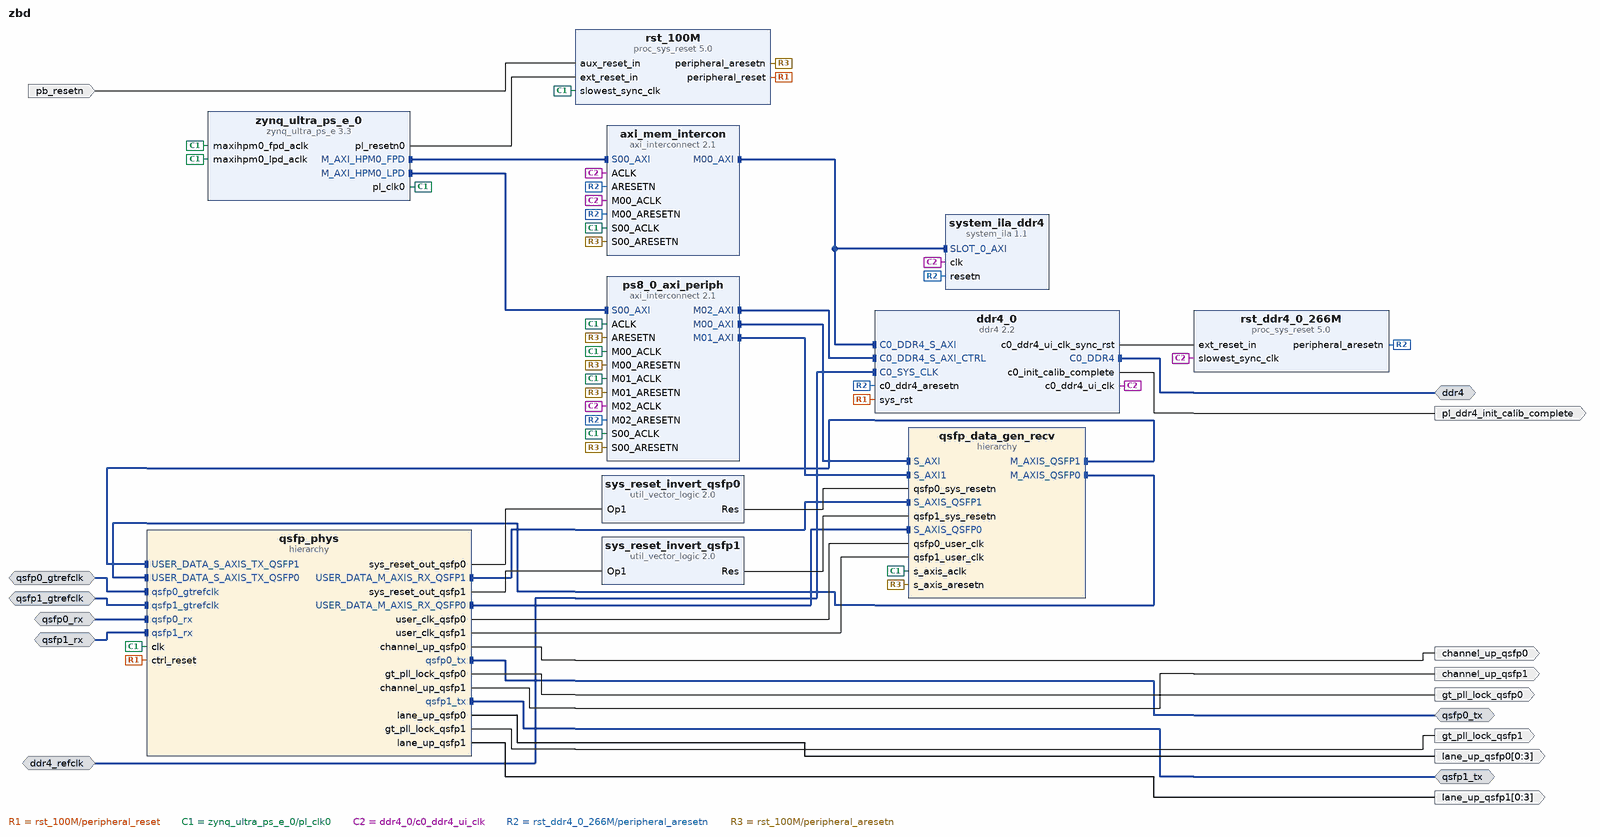
[diagram p0: block diagram of the top level]
# Vivado block design zbd, xczu19eg-ffvc1760-2-i, Vivado 2021.1
create_bd_design zbd

create_bd_intf_port -mode Master -vlnv xilinx.com:interface:ddr4_rtl:1.0 ddr4
create_bd_intf_port -mode Slave -vlnv xilinx.com:interface:diff_clock_rtl:1.0 ddr4_refclk
set_property -dict {CONFIG.FREQ_HZ 333333000} [get_bd_intf_ports ddr4_refclk]
create_bd_intf_port -mode Slave -vlnv xilinx.com:interface:diff_clock_rtl:1.0 qsfp0_gtrefclk
set_property -dict {CONFIG.FREQ_HZ 322265625} [get_bd_intf_ports qsfp0_gtrefclk]
create_bd_intf_port -mode Slave -vlnv xilinx.com:display_aurora:GT_Serial_Transceiver_Pins_RX_rtl:1.0 qsfp0_rx
create_bd_intf_port -mode Master -vlnv xilinx.com:display_aurora:GT_Serial_Transceiver_Pins_TX_rtl:1.0 qsfp0_tx
create_bd_intf_port -mode Slave -vlnv xilinx.com:interface:diff_clock_rtl:1.0 qsfp1_gtrefclk
set_property -dict {CONFIG.FREQ_HZ 322265625} [get_bd_intf_ports qsfp1_gtrefclk]
create_bd_intf_port -mode Slave -vlnv xilinx.com:display_aurora:GT_Serial_Transceiver_Pins_RX_rtl:1.0 qsfp1_rx
create_bd_intf_port -mode Master -vlnv xilinx.com:display_aurora:GT_Serial_Transceiver_Pins_TX_rtl:1.0 qsfp1_tx
create_bd_port -dir O channel_up_qsfp0
create_bd_port -dir O channel_up_qsfp1
create_bd_port -dir O gt_pll_lock_qsfp0
create_bd_port -dir O gt_pll_lock_qsfp1
create_bd_port -dir O -from 0 -to 3 lane_up_qsfp0
create_bd_port -dir O -from 0 -to 3 lane_up_qsfp1
create_bd_port -dir I -type rst pb_resetn
create_bd_port -dir O pl_ddr4_init_calib_complete

create_bd_cell -type hier qsfp_data_gen_recv
create_bd_cell -type hier qsfp_phys
create_bd_cell -type ip -vlnv xilinx.com:ip:proc_sys_reset:5.0 rst_100M
create_bd_cell -type ip -vlnv xilinx.com:ip:proc_sys_reset:5.0 rst_ddr4_0_266M
create_bd_cell -type ip -vlnv xilinx.com:ip:axi_interconnect:2.1 axi_mem_intercon
set_property -dict {CONFIG.NUM_MI 1} [get_bd_cells axi_mem_intercon]
create_bd_cell -type ip -vlnv xilinx.com:ip:ddr4:2.2 ddr4_0
set_property -dict [list \
  CONFIG.C0.CKE_WIDTH 2 \
  CONFIG.C0.CK_WIDTH 2 \
  CONFIG.C0.CS_WIDTH 2 \
  CONFIG.C0.DDR4_AxiAddressWidth 33 \
  CONFIG.C0.DDR4_AxiDataWidth 512 \
  CONFIG.C0.DDR4_CasLatency 15 \
  CONFIG.C0.DDR4_CasWriteLatency 11 \
  CONFIG.C0.DDR4_DataMask NO_DM_NO_DBI \
  CONFIG.C0.DDR4_DataWidth 72 \
  CONFIG.C0.DDR4_InputClockPeriod 3001 \
  CONFIG.C0.DDR4_MemoryPart MTA18ASF1G72HZ-2G3 \
  CONFIG.C0.DDR4_MemoryType SODIMMs \
  CONFIG.C0.DDR4_TimePeriod 938 \
  CONFIG.C0.ODT_WIDTH 2 \
] [get_bd_cells ddr4_0]
create_bd_cell -type ip -vlnv xilinx.com:ip:axi_interconnect:2.1 ps8_0_axi_periph
set_property -dict {CONFIG.NUM_MI 3} [get_bd_cells ps8_0_axi_periph]
create_bd_cell -type ip -vlnv xilinx.com:ip:util_vector_logic:2.0 sys_reset_invert_qsfp0
set_property -dict {CONFIG.C_OPERATION not CONFIG.C_SIZE 1} [get_bd_cells sys_reset_invert_qsfp0]
create_bd_cell -type ip -vlnv xilinx.com:ip:util_vector_logic:2.0 sys_reset_invert_qsfp1
set_property -dict {CONFIG.C_OPERATION not CONFIG.C_SIZE 1} [get_bd_cells sys_reset_invert_qsfp1]
create_bd_cell -type ip -vlnv xilinx.com:ip:system_ila:1.1 system_ila_ddr4
set_property -dict [list \
  CONFIG.ALL_PROBE_SAME_MU_CNT 2 \
  CONFIG.C_DATA_DEPTH 4096 \
  CONFIG.C_EN_STRG_QUAL 1 \
  CONFIG.C_MON_TYPE INTERFACE \
  CONFIG.C_PROBE0_MU_CNT 2 \
] [get_bd_cells system_ila_ddr4]
create_bd_cell -type ip -vlnv xilinx.com:ip:zynq_ultra_ps_e:3.3 zynq_ultra_ps_e_0
set_property -dict [list \
  CONFIG.CAN0_BOARD_INTERFACE custom \
  CONFIG.CAN1_BOARD_INTERFACE custom \
  CONFIG.CSU_BOARD_INTERFACE custom \
  CONFIG.DP_BOARD_INTERFACE custom \
  CONFIG.GEM0_BOARD_INTERFACE custom \
  CONFIG.GEM1_BOARD_INTERFACE custom \
  CONFIG.GEM2_BOARD_INTERFACE custom \
  CONFIG.GEM3_BOARD_INTERFACE custom \
  CONFIG.GPIO_BOARD_INTERFACE custom \
  CONFIG.IIC0_BOARD_INTERFACE custom \
  CONFIG.IIC1_BOARD_INTERFACE custom \
  CONFIG.NAND_BOARD_INTERFACE custom \
  CONFIG.PCIE_BOARD_INTERFACE custom \
  CONFIG.PJTAG_BOARD_INTERFACE custom \
  CONFIG.PMU_BOARD_INTERFACE custom \
  CONFIG.PSU_BANK_0_IO_STANDARD LVCMOS33 \
  CONFIG.PSU_BANK_1_IO_STANDARD LVCMOS33 \
  CONFIG.PSU_BANK_2_IO_STANDARD LVCMOS33 \
  CONFIG.PSU_BANK_3_IO_STANDARD LVCMOS33 \
  CONFIG.PSU_USB3__DUAL_CLOCK_ENABLE 0 \
  CONFIG.PSU__CAN1__PERIPHERAL__ENABLE 0 \
  CONFIG.PSU__CRF_APB__ACPU_CTRL__FREQMHZ 1333.333 \
  CONFIG.PSU__CRF_APB__ACPU_CTRL__SRCSEL APLL \
  CONFIG.PSU__CRF_APB__APLL_CTRL__SRCSEL PSS_REF_CLK \
  CONFIG.PSU__CRF_APB__DBG_FPD_CTRL__FREQMHZ 250 \
  CONFIG.PSU__CRF_APB__DBG_FPD_CTRL__SRCSEL IOPLL \
  CONFIG.PSU__CRF_APB__DBG_TRACE_CTRL__FREQMHZ 250 \
  CONFIG.PSU__CRF_APB__DBG_TRACE_CTRL__SRCSEL IOPLL \
  CONFIG.PSU__CRF_APB__DBG_TSTMP_CTRL__FREQMHZ 250 \
  CONFIG.PSU__CRF_APB__DBG_TSTMP_CTRL__SRCSEL IOPLL \
  CONFIG.PSU__CRF_APB__DDR_CTRL__FREQMHZ 800 \
  CONFIG.PSU__CRF_APB__DDR_CTRL__SRCSEL DPLL \
  CONFIG.PSU__CRF_APB__DPDMA_REF_CTRL__FREQMHZ 600 \
  CONFIG.PSU__CRF_APB__DPDMA_REF_CTRL__SRCSEL APLL \
  CONFIG.PSU__CRF_APB__DPLL_CTRL__SRCSEL PSS_REF_CLK \
  CONFIG.PSU__CRF_APB__DP_AUDIO_REF_CTRL__SRCSEL RPLL \
  CONFIG.PSU__CRF_APB__DP_STC_REF_CTRL__SRCSEL RPLL \
  CONFIG.PSU__CRF_APB__DP_VIDEO_REF_CTRL__SRCSEL VPLL \
  CONFIG.PSU__CRF_APB__GDMA_REF_CTRL__FREQMHZ 600 \
  CONFIG.PSU__CRF_APB__GDMA_REF_CTRL__SRCSEL APLL \
  CONFIG.PSU__CRF_APB__GPU_REF_CTRL__FREQMHZ 600 \
  CONFIG.PSU__CRF_APB__GPU_REF_CTRL__SRCSEL DPLL \
  CONFIG.PSU__CRF_APB__TOPSW_LSBUS_CTRL__FREQMHZ 100 \
  CONFIG.PSU__CRF_APB__TOPSW_LSBUS_CTRL__SRCSEL IOPLL \
  CONFIG.PSU__CRF_APB__TOPSW_MAIN_CTRL__FREQMHZ 533.33 \
  CONFIG.PSU__CRF_APB__TOPSW_MAIN_CTRL__SRCSEL VPLL \
  CONFIG.PSU__CRF_APB__VPLL_CTRL__SRCSEL PSS_REF_CLK \
  CONFIG.PSU__CRL_APB__ADMA_REF_CTRL__FREQMHZ 500 \
  CONFIG.PSU__CRL_APB__ADMA_REF_CTRL__SRCSEL IOPLL \
  CONFIG.PSU__CRL_APB__CAN1_REF_CTRL__FREQMHZ 100 \
  CONFIG.PSU__CRL_APB__CAN1_REF_CTRL__SRCSEL IOPLL \
  CONFIG.PSU__CRL_APB__CPU_R5_CTRL__FREQMHZ 533.333 \
  CONFIG.PSU__CRL_APB__CPU_R5_CTRL__SRCSEL IOPLL \
  CONFIG.PSU__CRL_APB__DBG_LPD_CTRL__FREQMHZ 250 \
  CONFIG.PSU__CRL_APB__DBG_LPD_CTRL__SRCSEL IOPLL \
  CONFIG.PSU__CRL_APB__DLL_REF_CTRL__FREQMHZ 200 \
  CONFIG.PSU__CRL_APB__GEM3_REF_CTRL__FREQMHZ 125 \
  CONFIG.PSU__CRL_APB__GEM3_REF_CTRL__SRCSEL IOPLL \
  CONFIG.PSU__CRL_APB__I2C0_REF_CTRL__FREQMHZ 100 \
  CONFIG.PSU__CRL_APB__I2C0_REF_CTRL__SRCSEL IOPLL \
  CONFIG.PSU__CRL_APB__I2C1_REF_CTRL__FREQMHZ 100 \
  CONFIG.PSU__CRL_APB__I2C1_REF_CTRL__SRCSEL IOPLL \
  CONFIG.PSU__CRL_APB__IOPLL_CTRL__SRCSEL PSS_REF_CLK \
  CONFIG.PSU__CRL_APB__IOU_SWITCH_CTRL__FREQMHZ 267 \
  CONFIG.PSU__CRL_APB__IOU_SWITCH_CTRL__SRCSEL RPLL \
  CONFIG.PSU__CRL_APB__LPD_LSBUS_CTRL__FREQMHZ 100 \
  CONFIG.PSU__CRL_APB__LPD_LSBUS_CTRL__SRCSEL IOPLL \
  CONFIG.PSU__CRL_APB__LPD_SWITCH_CTRL__FREQMHZ 533.333 \
  CONFIG.PSU__CRL_APB__LPD_SWITCH_CTRL__SRCSEL IOPLL \
  CONFIG.PSU__CRL_APB__PCAP_CTRL__FREQMHZ 200 \
  CONFIG.PSU__CRL_APB__PCAP_CTRL__SRCSEL IOPLL \
  CONFIG.PSU__CRL_APB__PL0_REF_CTRL__FREQMHZ 100 \
  CONFIG.PSU__CRL_APB__PL0_REF_CTRL__SRCSEL RPLL \
  CONFIG.PSU__CRL_APB__QSPI_REF_CTRL__FREQMHZ 300 \
  CONFIG.PSU__CRL_APB__QSPI_REF_CTRL__SRCSEL IOPLL \
  CONFIG.PSU__CRL_APB__RPLL_CTRL__SRCSEL PSS_REF_CLK \
  CONFIG.PSU__CRL_APB__SDIO1_REF_CTRL__FREQMHZ 200 \
  CONFIG.PSU__CRL_APB__SDIO1_REF_CTRL__SRCSEL RPLL \
  CONFIG.PSU__CRL_APB__TIMESTAMP_REF_CTRL__FREQMHZ 33.333 \
  CONFIG.PSU__CRL_APB__TIMESTAMP_REF_CTRL__SRCSEL PSS_REF_CLK \
  CONFIG.PSU__CRL_APB__UART0_REF_CTRL__FREQMHZ 100 \
  CONFIG.PSU__CRL_APB__UART0_REF_CTRL__SRCSEL IOPLL \
  CONFIG.PSU__CRL_APB__UART1_REF_CTRL__FREQMHZ 100 \
  CONFIG.PSU__CRL_APB__UART1_REF_CTRL__SRCSEL IOPLL \
  CONFIG.PSU__CRL_APB__USB0_BUS_REF_CTRL__FREQMHZ 250 \
  CONFIG.PSU__CRL_APB__USB0_BUS_REF_CTRL__SRCSEL IOPLL \
  CONFIG.PSU__CRL_APB__USB3_DUAL_REF_CTRL__FREQMHZ 20 \
  CONFIG.PSU__CRL_APB__USB3_DUAL_REF_CTRL__SRCSEL IOPLL \
  CONFIG.PSU__CRL_APB__USB3__ENABLE 0 \
  CONFIG.PSU__CSUPMU__PERIPHERAL__VALID 0 \
  CONFIG.PSU__DDRC__BUS_WIDTH {64 Bit} \
  CONFIG.PSU__DDRC__COMPONENTS UDIMM \
  CONFIG.PSU__DDRC__DEVICE_CAPACITY {8192 MBits} \
  CONFIG.PSU__DDRC__DRAM_WIDTH {8 Bits} \
  CONFIG.PSU__DDRC__ECC Disabled \
  CONFIG.PSU__DDRC__MEMORY_TYPE {DDR 4} \
  CONFIG.PSU__DDRC__SPEED_BIN DDR4_1600K \
  CONFIG.PSU__DDR_HIGH_ADDRESS_GUI_ENABLE 1 \
  CONFIG.PSU__DDR__INTERFACE__FREQMHZ 400.000 \
  CONFIG.PSU__DEVICE_TYPE EG \
  CONFIG.PSU__DISPLAYPORT__PERIPHERAL__ENABLE 0 \
  CONFIG.PSU__DLL__ISUSED 1 \
  CONFIG.PSU__ENET3__FIFO__ENABLE 0 \
  CONFIG.PSU__ENET3__GRP_MDIO__ENABLE 1 \
  CONFIG.PSU__ENET3__GRP_MDIO__IO {MIO 76 .. 77} \
  CONFIG.PSU__ENET3__PERIPHERAL__ENABLE 1 \
  CONFIG.PSU__ENET3__PERIPHERAL__IO {MIO 64 .. 75} \
  CONFIG.PSU__ENET3__PTP__ENABLE 0 \
  CONFIG.PSU__ENET3__TSU__ENABLE 0 \
  CONFIG.PSU__FPGA_PL0_ENABLE 1 \
  CONFIG.PSU__GEM3_COHERENCY 0 \
  CONFIG.PSU__GEM3_ROUTE_THROUGH_FPD 0 \
  CONFIG.PSU__GEM__TSU__ENABLE 0 \
  CONFIG.PSU__GPIO0_MIO__IO {MIO 0 .. 25} \
  CONFIG.PSU__GPIO0_MIO__PERIPHERAL__ENABLE 1 \
  CONFIG.PSU__GPIO1_MIO__IO {MIO 26 .. 51} \
  CONFIG.PSU__GPIO1_MIO__PERIPHERAL__ENABLE 1 \
  CONFIG.PSU__I2C0__PERIPHERAL__ENABLE 1 \
  CONFIG.PSU__I2C0__PERIPHERAL__IO {MIO 14 .. 15} \
  CONFIG.PSU__I2C1__PERIPHERAL__ENABLE 1 \
  CONFIG.PSU__I2C1__PERIPHERAL__IO {MIO 16 .. 17} \
  CONFIG.PSU__IOU_SLCR__IOU_TTC_APB_CLK__TTC0_SEL APB \
  CONFIG.PSU__IOU_SLCR__IOU_TTC_APB_CLK__TTC1_SEL APB \
  CONFIG.PSU__IOU_SLCR__IOU_TTC_APB_CLK__TTC2_SEL APB \
  CONFIG.PSU__IOU_SLCR__IOU_TTC_APB_CLK__TTC3_SEL APB \
  CONFIG.PSU__LPD_SLCR__CSUPMU__FREQMHZ 100 \
  CONFIG.PSU__MAXIGP0__DATA_WIDTH 64 \
  CONFIG.PSU__OVERRIDE_HPX_QOS 0 \
  CONFIG.PSU__OVERRIDE__BASIC_CLOCK 1 \
  CONFIG.PSU__PMU__PERIPHERAL__ENABLE 0 \
  CONFIG.PSU__PRESET_APPLIED 1 \
  CONFIG.PSU__PSS_REF_CLK__FREQMHZ 33.333 \
  CONFIG.PSU__QSPI_COHERENCY 0 \
  CONFIG.PSU__QSPI_ROUTE_THROUGH_FPD 0 \
  CONFIG.PSU__QSPI__GRP_FBCLK__ENABLE 1 \
  CONFIG.PSU__QSPI__GRP_FBCLK__IO {MIO 6} \
  CONFIG.PSU__QSPI__PERIPHERAL__DATA_MODE x4 \
  CONFIG.PSU__QSPI__PERIPHERAL__ENABLE 1 \
  CONFIG.PSU__QSPI__PERIPHERAL__IO {MIO 0 .. 12} \
  CONFIG.PSU__QSPI__PERIPHERAL__MODE {Dual Parallel} \
  CONFIG.PSU__SATA__PERIPHERAL__ENABLE 0 \
  CONFIG.PSU__SD1_COHERENCY 0 \
  CONFIG.PSU__SD1_ROUTE_THROUGH_FPD 0 \
  CONFIG.PSU__SD1__DATA_TRANSFER_MODE 4Bit \
  CONFIG.PSU__SD1__GRP_CD__ENABLE 1 \
  CONFIG.PSU__SD1__GRP_CD__IO {MIO 45} \
  CONFIG.PSU__SD1__GRP_POW__ENABLE 1 \
  CONFIG.PSU__SD1__GRP_POW__IO {MIO 43} \
  CONFIG.PSU__SD1__GRP_WP__ENABLE 1 \
  CONFIG.PSU__SD1__GRP_WP__IO {MIO 44} \
  CONFIG.PSU__SD1__PERIPHERAL__ENABLE 1 \
  CONFIG.PSU__SD1__PERIPHERAL__IO {MIO 46 .. 51} \
  CONFIG.PSU__SD1__SLOT_TYPE {SD 2.0} \
  CONFIG.PSU__SWDT0__CLOCK__ENABLE 0 \
  CONFIG.PSU__SWDT0__PERIPHERAL__ENABLE 1 \
  CONFIG.PSU__SWDT0__RESET__ENABLE 0 \
  CONFIG.PSU__SWDT1__CLOCK__ENABLE 0 \
  CONFIG.PSU__SWDT1__PERIPHERAL__ENABLE 1 \
  CONFIG.PSU__SWDT1__RESET__ENABLE 0 \
  CONFIG.PSU__TSU__BUFG_PORT_PAIR 0 \
  CONFIG.PSU__TTC0__CLOCK__ENABLE 0 \
  CONFIG.PSU__TTC0__PERIPHERAL__ENABLE 1 \
  CONFIG.PSU__TTC0__WAVEOUT__ENABLE 0 \
  CONFIG.PSU__TTC1__CLOCK__ENABLE 0 \
  CONFIG.PSU__TTC1__PERIPHERAL__ENABLE 1 \
  CONFIG.PSU__TTC1__WAVEOUT__ENABLE 0 \
  CONFIG.PSU__TTC2__CLOCK__ENABLE 0 \
  CONFIG.PSU__TTC2__PERIPHERAL__ENABLE 1 \
  CONFIG.PSU__TTC2__WAVEOUT__ENABLE 0 \
  CONFIG.PSU__TTC3__CLOCK__ENABLE 0 \
  CONFIG.PSU__TTC3__PERIPHERAL__ENABLE 1 \
  CONFIG.PSU__TTC3__WAVEOUT__ENABLE 0 \
  CONFIG.PSU__UART0__BAUD_RATE 115200 \
  CONFIG.PSU__UART0__MODEM__ENABLE 0 \
  CONFIG.PSU__UART0__PERIPHERAL__ENABLE 1 \
  CONFIG.PSU__UART0__PERIPHERAL__IO {MIO 18 .. 19} \
  CONFIG.PSU__UART1__BAUD_RATE 115200 \
  CONFIG.PSU__UART1__MODEM__ENABLE 0 \
  CONFIG.PSU__UART1__PERIPHERAL__ENABLE 1 \
  CONFIG.PSU__UART1__PERIPHERAL__IO {MIO 20 .. 21} \
  CONFIG.PSU__USB0__PERIPHERAL__ENABLE 0 \
  CONFIG.PSU__USE__IRQ0 0 \
  CONFIG.PSU__USE__M_AXI_GP0 1 \
  CONFIG.PSU__USE__M_AXI_GP1 0 \
  CONFIG.PSU__USE__M_AXI_GP2 1 \
  CONFIG.QSPI_BOARD_INTERFACE custom \
  CONFIG.SATA_BOARD_INTERFACE custom \
  CONFIG.SD0_BOARD_INTERFACE custom \
  CONFIG.SD1_BOARD_INTERFACE custom \
  CONFIG.SPI0_BOARD_INTERFACE custom \
  CONFIG.SPI1_BOARD_INTERFACE custom \
  CONFIG.SUBPRESET1 Custom \
  CONFIG.SUBPRESET2 Custom \
  CONFIG.SWDT0_BOARD_INTERFACE custom \
  CONFIG.SWDT1_BOARD_INTERFACE custom \
  CONFIG.TRACE_BOARD_INTERFACE custom \
  CONFIG.TTC0_BOARD_INTERFACE custom \
  CONFIG.TTC1_BOARD_INTERFACE custom \
  CONFIG.TTC2_BOARD_INTERFACE custom \
  CONFIG.TTC3_BOARD_INTERFACE custom \
  CONFIG.UART0_BOARD_INTERFACE custom \
  CONFIG.UART1_BOARD_INTERFACE custom \
  CONFIG.USB0_BOARD_INTERFACE custom \
  CONFIG.USB1_BOARD_INTERFACE custom \
] [get_bd_cells zynq_ultra_ps_e_0]
# 845 more settings of zynq_ultra_ps_e_0 are not shown: defaults, MIO pin electricals, DDR timing, and values the tool derives

# ---- hierarchy /qsfp_data_gen_recv ----
current_bd_instance /qsfp_data_gen_recv
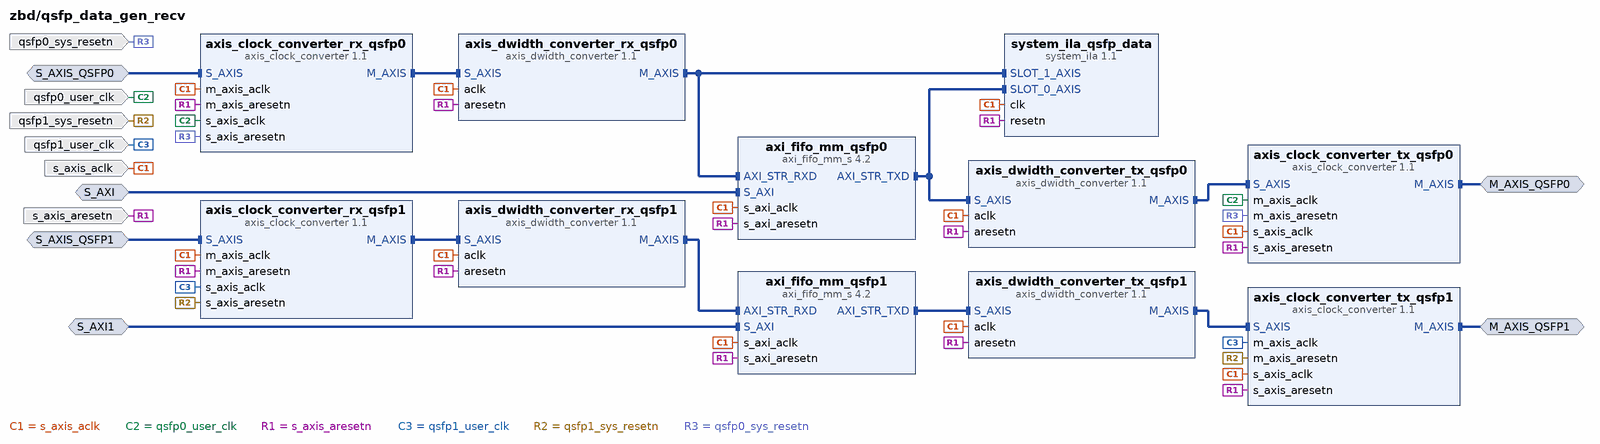
[diagram p1: block diagram inside /qsfp_data_gen_recv]
create_bd_intf_pin -mode Master -vlnv xilinx.com:interface:axis_rtl:1.0 M_AXIS_QSFP0
create_bd_intf_pin -mode Master -vlnv xilinx.com:interface:axis_rtl:1.0 M_AXIS_QSFP1
create_bd_intf_pin -mode Slave -vlnv xilinx.com:interface:aximm_rtl:1.0 S_AXI
create_bd_intf_pin -mode Slave -vlnv xilinx.com:interface:aximm_rtl:1.0 S_AXI1
create_bd_intf_pin -mode Slave -vlnv xilinx.com:interface:axis_rtl:1.0 S_AXIS_QSFP0
create_bd_intf_pin -mode Slave -vlnv xilinx.com:interface:axis_rtl:1.0 S_AXIS_QSFP1
create_bd_pin -dir I -type rst qsfp0_sys_resetn
create_bd_pin -dir I -type clk qsfp0_user_clk
create_bd_pin -dir I -type rst qsfp1_sys_resetn
create_bd_pin -dir I -type clk qsfp1_user_clk
create_bd_pin -dir I -type clk s_axis_aclk
create_bd_pin -dir I -type rst s_axis_aresetn

create_bd_cell -type ip -vlnv xilinx.com:ip:axi_fifo_mm_s:4.2 axi_fifo_mm_qsfp0
set_property -dict {CONFIG.C_USE_TX_CTRL 0} [get_bd_cells axi_fifo_mm_qsfp0]
create_bd_cell -type ip -vlnv xilinx.com:ip:axi_fifo_mm_s:4.2 axi_fifo_mm_qsfp1
set_property -dict {CONFIG.C_USE_TX_CTRL 0} [get_bd_cells axi_fifo_mm_qsfp1]
create_bd_cell -type ip -vlnv xilinx.com:ip:axis_clock_converter:1.1 axis_clock_converter_rx_qsfp0
create_bd_cell -type ip -vlnv xilinx.com:ip:axis_clock_converter:1.1 axis_clock_converter_rx_qsfp1
create_bd_cell -type ip -vlnv xilinx.com:ip:axis_clock_converter:1.1 axis_clock_converter_tx_qsfp0
create_bd_cell -type ip -vlnv xilinx.com:ip:axis_clock_converter:1.1 axis_clock_converter_tx_qsfp1
create_bd_cell -type ip -vlnv xilinx.com:ip:axis_dwidth_converter:1.1 axis_dwidth_converter_rx_qsfp0
set_property -dict {CONFIG.M_TDATA_NUM_BYTES 4} [get_bd_cells axis_dwidth_converter_rx_qsfp0]
create_bd_cell -type ip -vlnv xilinx.com:ip:axis_dwidth_converter:1.1 axis_dwidth_converter_rx_qsfp1
set_property -dict {CONFIG.M_TDATA_NUM_BYTES 4} [get_bd_cells axis_dwidth_converter_rx_qsfp1]
create_bd_cell -type ip -vlnv xilinx.com:ip:axis_dwidth_converter:1.1 axis_dwidth_converter_tx_qsfp0
set_property -dict {CONFIG.HAS_MI_TKEEP 1 CONFIG.M_TDATA_NUM_BYTES 32} [get_bd_cells axis_dwidth_converter_tx_qsfp0]
create_bd_cell -type ip -vlnv xilinx.com:ip:axis_dwidth_converter:1.1 axis_dwidth_converter_tx_qsfp1
set_property -dict {CONFIG.HAS_MI_TKEEP 1 CONFIG.M_TDATA_NUM_BYTES 32} [get_bd_cells axis_dwidth_converter_tx_qsfp1]
create_bd_cell -type ip -vlnv xilinx.com:ip:system_ila:1.1 system_ila_qsfp_data
set_property -dict [list \
  CONFIG.ALL_PROBE_SAME_MU_CNT 2 \
  CONFIG.C_DATA_DEPTH 4096 \
  CONFIG.C_EN_STRG_QUAL 1 \
  CONFIG.C_MON_TYPE INTERFACE \
  CONFIG.C_NUM_MONITOR_SLOTS 2 \
  CONFIG.C_PROBE0_MU_CNT 2 \
  CONFIG.C_SLOT 1 \
  CONFIG.C_SLOT_0_INTF_TYPE xilinx.com:interface:axis_rtl:1.0 \
  CONFIG.C_SLOT_1_INTF_TYPE xilinx.com:interface:axis_rtl:1.0 \
] [get_bd_cells system_ila_qsfp_data]

# ---- hierarchy /qsfp_phys ----
current_bd_instance /qsfp_phys
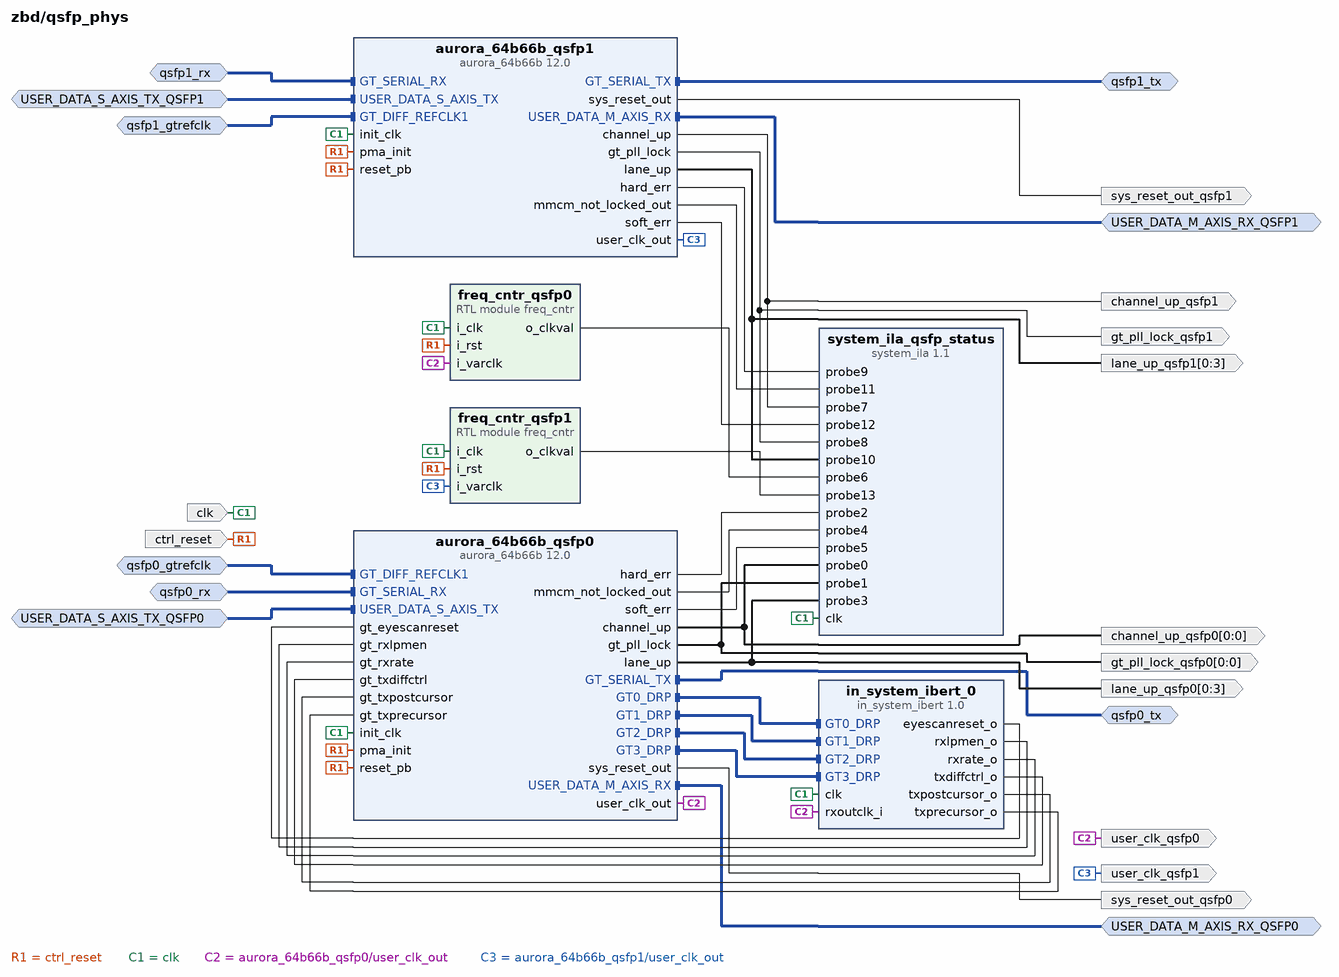
[diagram p2: block diagram inside /qsfp_phys]
create_bd_intf_pin -mode Master -vlnv xilinx.com:interface:axis_rtl:1.0 USER_DATA_M_AXIS_RX_QSFP0
create_bd_intf_pin -mode Master -vlnv xilinx.com:interface:axis_rtl:1.0 USER_DATA_M_AXIS_RX_QSFP1
create_bd_intf_pin -mode Slave -vlnv xilinx.com:interface:axis_rtl:1.0 USER_DATA_S_AXIS_TX_QSFP0
create_bd_intf_pin -mode Slave -vlnv xilinx.com:interface:axis_rtl:1.0 USER_DATA_S_AXIS_TX_QSFP1
create_bd_intf_pin -mode Slave -vlnv xilinx.com:interface:diff_clock_rtl:1.0 qsfp0_gtrefclk
create_bd_intf_pin -mode Slave -vlnv xilinx.com:display_aurora:GT_Serial_Transceiver_Pins_RX_rtl:1.0 qsfp0_rx
create_bd_intf_pin -mode Master -vlnv xilinx.com:display_aurora:GT_Serial_Transceiver_Pins_TX_rtl:1.0 qsfp0_tx
create_bd_intf_pin -mode Slave -vlnv xilinx.com:interface:diff_clock_rtl:1.0 qsfp1_gtrefclk
create_bd_intf_pin -mode Slave -vlnv xilinx.com:display_aurora:GT_Serial_Transceiver_Pins_RX_rtl:1.0 qsfp1_rx
create_bd_intf_pin -mode Master -vlnv xilinx.com:display_aurora:GT_Serial_Transceiver_Pins_TX_rtl:1.0 qsfp1_tx
create_bd_pin -dir O -from 0 -to 0 channel_up_qsfp0
create_bd_pin -dir O channel_up_qsfp1
create_bd_pin -dir I -type clk clk
create_bd_pin -dir I -type rst ctrl_reset
create_bd_pin -dir O -from 0 -to 0 gt_pll_lock_qsfp0
create_bd_pin -dir O gt_pll_lock_qsfp1
create_bd_pin -dir O -from 0 -to 3 lane_up_qsfp0
create_bd_pin -dir O -from 0 -to 3 lane_up_qsfp1
create_bd_pin -dir O -type rst sys_reset_out_qsfp0
create_bd_pin -dir O -type rst sys_reset_out_qsfp1
create_bd_pin -dir O user_clk_qsfp0
create_bd_pin -dir O user_clk_qsfp1

create_bd_cell -type module -reference freq_cntr freq_cntr_qsfp1
set_property -dict {CONFIG.pPPS_CNT_VALUE 99999001} [get_bd_cells freq_cntr_qsfp1]
create_bd_cell -type ip -vlnv xilinx.com:ip:aurora_64b66b:12.0 aurora_64b66b_qsfp0
set_property -dict [list \
  CONFIG.CHANNEL_ENABLE {X0Y12 X0Y13 X0Y14 X0Y15} \
  CONFIG.C_AURORA_LANES 4 \
  CONFIG.C_GT_CLOCK_1 GTYQ0 \
  CONFIG.C_GT_TYPE GTY \
  CONFIG.C_LINE_RATE 10.3125 \
  CONFIG.C_REFCLK_FREQUENCY 322.265625 \
  CONFIG.C_REFCLK_SOURCE MGTREFCLK0_of_Quad_X0Y3 \
  CONFIG.C_START_LANE X0Y12 \
  CONFIG.C_START_QUAD Quad_X0Y3 \
  CONFIG.C_UCOLUMN_USED left \
  CONFIG.C_USE_CHIPSCOPE false \
  CONFIG.SupportLevel 1 \
  CONFIG.TransceiverControl true \
  CONFIG.drp_mode Native \
  CONFIG.interface_mode Framing \
] [get_bd_cells aurora_64b66b_qsfp0]
create_bd_cell -type ip -vlnv xilinx.com:ip:aurora_64b66b:12.0 aurora_64b66b_qsfp1
set_property -dict [list \
  CONFIG.CHANNEL_ENABLE {X0Y16 X0Y17 X0Y18 X0Y19} \
  CONFIG.C_AURORA_LANES 4 \
  CONFIG.C_GT_CLOCK_1 GTYQ0 \
  CONFIG.C_GT_TYPE GTY \
  CONFIG.C_LINE_RATE 10.3125 \
  CONFIG.C_REFCLK_FREQUENCY 322.265625 \
  CONFIG.C_REFCLK_SOURCE MGTREFCLK0_of_Quad_X0Y4 \
  CONFIG.C_START_LANE X0Y16 \
  CONFIG.C_START_QUAD Quad_X0Y4 \
  CONFIG.C_UCOLUMN_USED left \
  CONFIG.C_USE_CHIPSCOPE false \
  CONFIG.SupportLevel 1 \
  CONFIG.TransceiverControl false \
  CONFIG.drp_mode Disabled \
  CONFIG.interface_mode Framing \
] [get_bd_cells aurora_64b66b_qsfp1]
create_bd_cell -type ip -vlnv xilinx.com:ip:in_system_ibert:1.0 in_system_ibert_0
set_property -dict [list \
  CONFIG.C_ENABLE_INPUT_PORTS false \
  CONFIG.C_GTS_USED { X0Y15 X0Y14 X0Y13 X0Y12} \
  CONFIG.C_GT_TYPE GTY \
] [get_bd_cells in_system_ibert_0]
create_bd_cell -type ip -vlnv xilinx.com:ip:system_ila:1.1 system_ila_qsfp_status
set_property -dict [list \
  CONFIG.ALL_PROBE_SAME_MU false \
  CONFIG.ALL_PROBE_SAME_MU_CNT 2 \
  CONFIG.C_DATA_DEPTH 4096 \
  CONFIG.C_EN_STRG_QUAL 1 \
  CONFIG.C_MON_TYPE NATIVE \
  CONFIG.C_NUM_MONITOR_SLOTS 2 \
  CONFIG.C_NUM_OF_PROBES 14 \
  CONFIG.C_PROBE0_MU_CNT 2 \
  CONFIG.C_PROBE10_MU_CNT 2 \
  CONFIG.C_PROBE11_MU_CNT 2 \
  CONFIG.C_PROBE12_MU_CNT 2 \
  CONFIG.C_PROBE13_MU_CNT 2 \
  CONFIG.C_PROBE1_MU_CNT 2 \
  CONFIG.C_PROBE2_MU_CNT 2 \
  CONFIG.C_PROBE3_MU_CNT 2 \
  CONFIG.C_PROBE4_MU_CNT 2 \
  CONFIG.C_PROBE5_MU_CNT 2 \
  CONFIG.C_PROBE6_MU_CNT 2 \
  CONFIG.C_PROBE7_MU_CNT 2 \
  CONFIG.C_PROBE8_MU_CNT 2 \
  CONFIG.C_PROBE9_MU_CNT 2 \
  CONFIG.C_SLOT 1 \
  CONFIG.C_SLOT_0_INTF_TYPE xilinx.com:interface:axis_rtl:1.0 \
  CONFIG.C_SLOT_1_INTF_TYPE xilinx.com:interface:axis_rtl:1.0 \
] [get_bd_cells system_ila_qsfp_status]
create_bd_cell -type module -reference freq_cntr freq_cntr_qsfp0
set_property -dict {CONFIG.pPPS_CNT_VALUE 99999001} [get_bd_cells freq_cntr_qsfp0]

# ---- connections ----

current_bd_instance /qsfp_data_gen_recv
connect_bd_intf_net [get_bd_intf_pins S_AXIS_QSFP1] [get_bd_intf_pins axis_clock_converter_rx_qsfp1/S_AXIS]
connect_bd_intf_net [get_bd_intf_pins M_AXIS_QSFP1] [get_bd_intf_pins axis_clock_converter_tx_qsfp1/M_AXIS]
connect_bd_intf_net [get_bd_intf_pins S_AXI1] [get_bd_intf_pins axi_fifo_mm_qsfp1/S_AXI]
connect_bd_intf_net [get_bd_intf_pins S_AXIS_QSFP0] [get_bd_intf_pins axis_clock_converter_rx_qsfp0/S_AXIS]
connect_bd_intf_net [get_bd_intf_pins axi_fifo_mm_qsfp0/AXI_STR_TXD] [get_bd_intf_pins axis_dwidth_converter_tx_qsfp0/S_AXIS]
connect_bd_intf_net [get_bd_intf_pins axi_fifo_mm_qsfp0/AXI_STR_TXD] [get_bd_intf_pins system_ila_qsfp_data/SLOT_0_AXIS]
connect_bd_intf_net [get_bd_intf_pins axi_fifo_mm_qsfp1/AXI_STR_TXD] [get_bd_intf_pins axis_dwidth_converter_tx_qsfp1/S_AXIS]
connect_bd_intf_net -intf_net axis_clock_converter_0_M_AXIS [get_bd_intf_pins M_AXIS_QSFP0] [get_bd_intf_pins axis_clock_converter_tx_qsfp0/M_AXIS]
connect_bd_intf_net -intf_net axis_clock_converter_1_M_AXIS [get_bd_intf_pins axis_clock_converter_rx_qsfp0/M_AXIS] [get_bd_intf_pins axis_dwidth_converter_rx_qsfp0/S_AXIS]
connect_bd_intf_net [get_bd_intf_pins axis_clock_converter_rx_qsfp1/M_AXIS] [get_bd_intf_pins axis_dwidth_converter_rx_qsfp1/S_AXIS]
connect_bd_intf_net -intf_net axis_dwidth_converter_0_M_AXIS [get_bd_intf_pins axis_clock_converter_tx_qsfp0/S_AXIS] [get_bd_intf_pins axis_dwidth_converter_tx_qsfp0/M_AXIS]
connect_bd_intf_net -intf_net axis_dwidth_converter_1_M_AXIS [get_bd_intf_pins axi_fifo_mm_qsfp0/AXI_STR_RXD] [get_bd_intf_pins axis_dwidth_converter_rx_qsfp0/M_AXIS]
connect_bd_intf_net [get_bd_intf_pins axi_fifo_mm_qsfp0/AXI_STR_RXD] [get_bd_intf_pins system_ila_qsfp_data/SLOT_1_AXIS]
connect_bd_intf_net [get_bd_intf_pins axi_fifo_mm_qsfp1/AXI_STR_RXD] [get_bd_intf_pins axis_dwidth_converter_rx_qsfp1/M_AXIS]
connect_bd_intf_net [get_bd_intf_pins axis_clock_converter_tx_qsfp1/S_AXIS] [get_bd_intf_pins axis_dwidth_converter_tx_qsfp1/M_AXIS]
connect_bd_intf_net [get_bd_intf_pins S_AXI] [get_bd_intf_pins axi_fifo_mm_qsfp0/S_AXI]
connect_bd_net [get_bd_pins s_axis_aclk] \
  [get_bd_pins axi_fifo_mm_qsfp0/s_axi_aclk] [get_bd_pins axi_fifo_mm_qsfp1/s_axi_aclk] \
  [get_bd_pins axis_clock_converter_rx_qsfp0/m_axis_aclk] [get_bd_pins axis_clock_converter_rx_qsfp1/m_axis_aclk] \
  [get_bd_pins axis_clock_converter_tx_qsfp0/s_axis_aclk] [get_bd_pins axis_clock_converter_tx_qsfp1/s_axis_aclk] \
  [get_bd_pins axis_dwidth_converter_rx_qsfp0/aclk] [get_bd_pins axis_dwidth_converter_rx_qsfp1/aclk] \
  [get_bd_pins axis_dwidth_converter_tx_qsfp0/aclk] [get_bd_pins axis_dwidth_converter_tx_qsfp1/aclk] \
  [get_bd_pins system_ila_qsfp_data/clk]
connect_bd_net -net aurora_64b66b_qsfp0_user_clk_out [get_bd_pins qsfp0_user_clk] \
  [get_bd_pins axis_clock_converter_rx_qsfp0/s_axis_aclk] [get_bd_pins axis_clock_converter_tx_qsfp0/m_axis_aclk]
connect_bd_net -net rst_ps8_0_99M_peripheral_aresetn [get_bd_pins s_axis_aresetn] \
  [get_bd_pins axi_fifo_mm_qsfp0/s_axi_aresetn] [get_bd_pins axi_fifo_mm_qsfp1/s_axi_aresetn] \
  [get_bd_pins axis_clock_converter_rx_qsfp0/m_axis_aresetn] [get_bd_pins axis_clock_converter_rx_qsfp1/m_axis_aresetn] \
  [get_bd_pins axis_clock_converter_tx_qsfp0/s_axis_aresetn] [get_bd_pins axis_clock_converter_tx_qsfp1/s_axis_aresetn] \
  [get_bd_pins axis_dwidth_converter_rx_qsfp0/aresetn] [get_bd_pins axis_dwidth_converter_rx_qsfp1/aresetn] \
  [get_bd_pins axis_dwidth_converter_tx_qsfp0/aresetn] [get_bd_pins axis_dwidth_converter_tx_qsfp1/aresetn] \
  [get_bd_pins system_ila_qsfp_data/resetn]
connect_bd_net -net s_axis_aclk_0_1 [get_bd_pins qsfp1_user_clk] \
  [get_bd_pins axis_clock_converter_rx_qsfp1/s_axis_aclk] [get_bd_pins axis_clock_converter_tx_qsfp1/m_axis_aclk]
connect_bd_net -net s_axis_aresetn_0_1 [get_bd_pins qsfp1_sys_resetn] \
  [get_bd_pins axis_clock_converter_rx_qsfp1/s_axis_aresetn] [get_bd_pins axis_clock_converter_tx_qsfp1/m_axis_aresetn]
connect_bd_net -net util_vector_logic_0_Res [get_bd_pins qsfp0_sys_resetn] \
  [get_bd_pins axis_clock_converter_rx_qsfp0/s_axis_aresetn] [get_bd_pins axis_clock_converter_tx_qsfp0/m_axis_aresetn]

current_bd_instance /qsfp_phys
connect_bd_intf_net [get_bd_intf_pins USER_DATA_M_AXIS_RX_QSFP1] [get_bd_intf_pins aurora_64b66b_qsfp1/USER_DATA_M_AXIS_RX]
connect_bd_intf_net [get_bd_intf_pins qsfp1_tx] [get_bd_intf_pins aurora_64b66b_qsfp1/GT_SERIAL_TX]
connect_bd_intf_net [get_bd_intf_pins qsfp1_rx] [get_bd_intf_pins aurora_64b66b_qsfp1/GT_SERIAL_RX]
connect_bd_intf_net [get_bd_intf_pins USER_DATA_S_AXIS_TX_QSFP1] [get_bd_intf_pins aurora_64b66b_qsfp1/USER_DATA_S_AXIS_TX]
connect_bd_intf_net [get_bd_intf_pins qsfp1_gtrefclk] [get_bd_intf_pins aurora_64b66b_qsfp1/GT_DIFF_REFCLK1]
connect_bd_intf_net -intf_net GT_DIFF_REFCLK1_0_1 [get_bd_intf_pins qsfp0_gtrefclk] [get_bd_intf_pins aurora_64b66b_qsfp0/GT_DIFF_REFCLK1]
connect_bd_intf_net -intf_net GT_SERIAL_RX_0_1 [get_bd_intf_pins qsfp0_rx] [get_bd_intf_pins aurora_64b66b_qsfp0/GT_SERIAL_RX]
connect_bd_intf_net [get_bd_intf_pins qsfp0_tx] [get_bd_intf_pins aurora_64b66b_qsfp0/GT_SERIAL_TX]
connect_bd_intf_net [get_bd_intf_pins USER_DATA_M_AXIS_RX_QSFP0] [get_bd_intf_pins aurora_64b66b_qsfp0/USER_DATA_M_AXIS_RX]
connect_bd_intf_net -intf_net axis_data_fifo_0_M_AXIS [get_bd_intf_pins USER_DATA_S_AXIS_TX_QSFP0] [get_bd_intf_pins aurora_64b66b_qsfp0/USER_DATA_S_AXIS_TX]
connect_bd_intf_net [get_bd_intf_pins aurora_64b66b_qsfp0/GT0_DRP] [get_bd_intf_pins in_system_ibert_0/GT0_DRP]
connect_bd_intf_net [get_bd_intf_pins aurora_64b66b_qsfp0/GT1_DRP] [get_bd_intf_pins in_system_ibert_0/GT1_DRP]
connect_bd_intf_net [get_bd_intf_pins aurora_64b66b_qsfp0/GT2_DRP] [get_bd_intf_pins in_system_ibert_0/GT2_DRP]
connect_bd_intf_net [get_bd_intf_pins aurora_64b66b_qsfp0/GT3_DRP] [get_bd_intf_pins in_system_ibert_0/GT3_DRP]
connect_bd_net [get_bd_pins ctrl_reset] \
  [get_bd_pins freq_cntr_qsfp1/i_rst] [get_bd_pins aurora_64b66b_qsfp0/reset_pb] [get_bd_pins aurora_64b66b_qsfp0/pma_init] \
  [get_bd_pins aurora_64b66b_qsfp1/reset_pb] [get_bd_pins aurora_64b66b_qsfp1/pma_init] [get_bd_pins freq_cntr_qsfp0/i_rst]
connect_bd_net [get_bd_pins clk] \
  [get_bd_pins freq_cntr_qsfp1/i_clk] [get_bd_pins aurora_64b66b_qsfp0/init_clk] [get_bd_pins aurora_64b66b_qsfp1/init_clk] \
  [get_bd_pins in_system_ibert_0/clk] [get_bd_pins system_ila_qsfp_status/clk] [get_bd_pins freq_cntr_qsfp0/i_clk]
connect_bd_net [get_bd_pins aurora_64b66b_qsfp0/channel_up] [get_bd_pins channel_up_qsfp0] [get_bd_pins system_ila_qsfp_status/probe0]
connect_bd_net [get_bd_pins aurora_64b66b_qsfp0/gt_pll_lock] [get_bd_pins gt_pll_lock_qsfp0] [get_bd_pins system_ila_qsfp_status/probe1]
connect_bd_net [get_bd_pins aurora_64b66b_qsfp0/hard_err] [get_bd_pins system_ila_qsfp_status/probe2]
connect_bd_net [get_bd_pins aurora_64b66b_qsfp0/lane_up] [get_bd_pins lane_up_qsfp0] [get_bd_pins system_ila_qsfp_status/probe3]
connect_bd_net [get_bd_pins aurora_64b66b_qsfp0/mmcm_not_locked_out] [get_bd_pins system_ila_qsfp_status/probe4]
connect_bd_net [get_bd_pins aurora_64b66b_qsfp0/soft_err] [get_bd_pins system_ila_qsfp_status/probe5]
connect_bd_net [get_bd_pins aurora_64b66b_qsfp0/sys_reset_out] [get_bd_pins sys_reset_out_qsfp0]
connect_bd_net [get_bd_pins aurora_64b66b_qsfp0/user_clk_out] \
  [get_bd_pins user_clk_qsfp0] [get_bd_pins in_system_ibert_0/rxoutclk_i] [get_bd_pins freq_cntr_qsfp0/i_varclk]
connect_bd_net [get_bd_pins aurora_64b66b_qsfp1/channel_up] [get_bd_pins channel_up_qsfp1] [get_bd_pins system_ila_qsfp_status/probe7]
connect_bd_net [get_bd_pins aurora_64b66b_qsfp1/gt_pll_lock] [get_bd_pins gt_pll_lock_qsfp1] [get_bd_pins system_ila_qsfp_status/probe8]
connect_bd_net [get_bd_pins aurora_64b66b_qsfp1/hard_err] [get_bd_pins system_ila_qsfp_status/probe9]
connect_bd_net [get_bd_pins aurora_64b66b_qsfp1/lane_up] [get_bd_pins lane_up_qsfp1] [get_bd_pins system_ila_qsfp_status/probe10]
connect_bd_net [get_bd_pins aurora_64b66b_qsfp1/mmcm_not_locked_out] [get_bd_pins system_ila_qsfp_status/probe11]
connect_bd_net [get_bd_pins aurora_64b66b_qsfp1/soft_err] [get_bd_pins system_ila_qsfp_status/probe12]
connect_bd_net [get_bd_pins aurora_64b66b_qsfp1/sys_reset_out] [get_bd_pins sys_reset_out_qsfp1]
connect_bd_net [get_bd_pins aurora_64b66b_qsfp1/user_clk_out] [get_bd_pins user_clk_qsfp1] [get_bd_pins freq_cntr_qsfp1/i_varclk]
connect_bd_net -net freq_cntr_0_o_clkval [get_bd_pins freq_cntr_qsfp0/o_clkval] [get_bd_pins system_ila_qsfp_status/probe6]
connect_bd_net [get_bd_pins freq_cntr_qsfp1/o_clkval] [get_bd_pins system_ila_qsfp_status/probe13]
connect_bd_net [get_bd_pins in_system_ibert_0/eyescanreset_o] [get_bd_pins aurora_64b66b_qsfp0/gt_eyescanreset]
connect_bd_net [get_bd_pins in_system_ibert_0/rxlpmen_o] [get_bd_pins aurora_64b66b_qsfp0/gt_rxlpmen]
connect_bd_net [get_bd_pins in_system_ibert_0/rxrate_o] [get_bd_pins aurora_64b66b_qsfp0/gt_rxrate]
connect_bd_net [get_bd_pins in_system_ibert_0/txdiffctrl_o] [get_bd_pins aurora_64b66b_qsfp0/gt_txdiffctrl]
connect_bd_net [get_bd_pins in_system_ibert_0/txpostcursor_o] [get_bd_pins aurora_64b66b_qsfp0/gt_txpostcursor]
connect_bd_net [get_bd_pins in_system_ibert_0/txprecursor_o] [get_bd_pins aurora_64b66b_qsfp0/gt_txprecursor]

current_bd_instance /
connect_bd_intf_net -intf_net C0_SYS_CLK_0_1 [get_bd_intf_ports ddr4_refclk] [get_bd_intf_pins ddr4_0/C0_SYS_CLK]
connect_bd_intf_net -intf_net GT_DIFF_REFCLK1_0_1 [get_bd_intf_ports qsfp0_gtrefclk] [get_bd_intf_pins qsfp_phys/qsfp0_gtrefclk]
connect_bd_intf_net -intf_net GT_DIFF_REFCLK1_0_2 [get_bd_intf_ports qsfp1_gtrefclk] [get_bd_intf_pins qsfp_phys/qsfp1_gtrefclk]
connect_bd_intf_net -intf_net GT_SERIAL_RX_0_1 [get_bd_intf_ports qsfp0_rx] [get_bd_intf_pins qsfp_phys/qsfp0_rx]
connect_bd_intf_net -intf_net GT_SERIAL_RX_0_2 [get_bd_intf_ports qsfp1_rx] [get_bd_intf_pins qsfp_phys/qsfp1_rx]
connect_bd_intf_net -intf_net S_AXIS_QSFP1_1 [get_bd_intf_pins qsfp_data_gen_recv/S_AXIS_QSFP1] [get_bd_intf_pins qsfp_phys/USER_DATA_M_AXIS_RX_QSFP1]
connect_bd_intf_net -intf_net USER_DATA_S_AXIS_TX_QSFP1_1 [get_bd_intf_pins qsfp_data_gen_recv/M_AXIS_QSFP1] [get_bd_intf_pins qsfp_phys/USER_DATA_S_AXIS_TX_QSFP1]
connect_bd_intf_net -intf_net aurora_64b66b_qsfp0_GT_SERIAL_TX [get_bd_intf_ports qsfp0_tx] [get_bd_intf_pins qsfp_phys/qsfp0_tx]
connect_bd_intf_net -intf_net aurora_64b66b_qsfp0_USER_DATA_M_AXIS_RX [get_bd_intf_pins qsfp_data_gen_recv/S_AXIS_QSFP0] [get_bd_intf_pins qsfp_phys/USER_DATA_M_AXIS_RX_QSFP0]
connect_bd_intf_net [get_bd_intf_pins axi_mem_intercon/M00_AXI] [get_bd_intf_pins ddr4_0/C0_DDR4_S_AXI]
connect_bd_intf_net [get_bd_intf_pins axi_mem_intercon/M00_AXI] [get_bd_intf_pins system_ila_ddr4/SLOT_0_AXI]
connect_bd_intf_net -intf_net axis_data_fifo_0_M_AXIS [get_bd_intf_pins qsfp_data_gen_recv/M_AXIS_QSFP0] [get_bd_intf_pins qsfp_phys/USER_DATA_S_AXIS_TX_QSFP0]
connect_bd_intf_net [get_bd_intf_ports ddr4] [get_bd_intf_pins ddr4_0/C0_DDR4]
connect_bd_intf_net [get_bd_intf_pins ps8_0_axi_periph/M00_AXI] [get_bd_intf_pins qsfp_data_gen_recv/S_AXI]
connect_bd_intf_net [get_bd_intf_pins ps8_0_axi_periph/M01_AXI] [get_bd_intf_pins qsfp_data_gen_recv/S_AXI1]
connect_bd_intf_net [get_bd_intf_pins ddr4_0/C0_DDR4_S_AXI_CTRL] [get_bd_intf_pins ps8_0_axi_periph/M02_AXI]
connect_bd_intf_net [get_bd_intf_ports qsfp1_tx] [get_bd_intf_pins qsfp_phys/qsfp1_tx]
connect_bd_intf_net [get_bd_intf_pins axi_mem_intercon/S00_AXI] [get_bd_intf_pins zynq_ultra_ps_e_0/M_AXI_HPM0_FPD]
connect_bd_intf_net [get_bd_intf_pins ps8_0_axi_periph/S00_AXI] [get_bd_intf_pins zynq_ultra_ps_e_0/M_AXI_HPM0_LPD]
connect_bd_net [get_bd_pins rst_100M/peripheral_reset] [get_bd_pins qsfp_phys/ctrl_reset] [get_bd_pins ddr4_0/sys_rst]
connect_bd_net [get_bd_pins zynq_ultra_ps_e_0/pl_clk0] \
  [get_bd_pins qsfp_data_gen_recv/s_axis_aclk] [get_bd_pins qsfp_phys/clk] [get_bd_pins rst_100M/slowest_sync_clk] \
  [get_bd_pins axi_mem_intercon/S00_ACLK] [get_bd_pins ps8_0_axi_periph/ACLK] [get_bd_pins ps8_0_axi_periph/S00_ACLK] \
  [get_bd_pins ps8_0_axi_periph/M00_ACLK] [get_bd_pins ps8_0_axi_periph/M01_ACLK] \
  [get_bd_pins zynq_ultra_ps_e_0/maxihpm0_fpd_aclk] [get_bd_pins zynq_ultra_ps_e_0/maxihpm0_lpd_aclk]
connect_bd_net -net aurora_64b66b_qsfp0_channel_up [get_bd_pins qsfp_phys/channel_up_qsfp0] [get_bd_ports channel_up_qsfp0]
connect_bd_net -net aurora_64b66b_qsfp0_gt_pll_lock [get_bd_pins qsfp_phys/gt_pll_lock_qsfp0] [get_bd_ports gt_pll_lock_qsfp0]
connect_bd_net -net aurora_64b66b_qsfp0_lane_up [get_bd_pins qsfp_phys/lane_up_qsfp0] [get_bd_ports lane_up_qsfp0]
connect_bd_net -net aurora_64b66b_qsfp0_sys_reset_out [get_bd_pins qsfp_phys/sys_reset_out_qsfp0] [get_bd_pins sys_reset_invert_qsfp0/Op1]
connect_bd_net -net aurora_64b66b_qsfp0_user_clk_out [get_bd_pins qsfp_phys/user_clk_qsfp0] [get_bd_pins qsfp_data_gen_recv/qsfp0_user_clk]
connect_bd_net -net aux_reset_in_0_1 [get_bd_ports pb_resetn] [get_bd_pins rst_100M/aux_reset_in]
connect_bd_net [get_bd_pins ddr4_0/c0_ddr4_ui_clk] \
  [get_bd_pins rst_ddr4_0_266M/slowest_sync_clk] [get_bd_pins axi_mem_intercon/ACLK] [get_bd_pins axi_mem_intercon/M00_ACLK] \
  [get_bd_pins ps8_0_axi_periph/M02_ACLK] [get_bd_pins system_ila_ddr4/clk]
connect_bd_net [get_bd_pins ddr4_0/c0_ddr4_ui_clk_sync_rst] [get_bd_pins rst_ddr4_0_266M/ext_reset_in]
connect_bd_net [get_bd_pins ddr4_0/c0_init_calib_complete] [get_bd_ports pl_ddr4_init_calib_complete]
connect_bd_net -net qsfp_phys_channel_up_0 [get_bd_pins qsfp_phys/channel_up_qsfp1] [get_bd_ports channel_up_qsfp1]
connect_bd_net -net qsfp_phys_gt_pll_lock_0 [get_bd_pins qsfp_phys/gt_pll_lock_qsfp1] [get_bd_ports gt_pll_lock_qsfp1]
connect_bd_net -net qsfp_phys_lane_up_0 [get_bd_pins qsfp_phys/lane_up_qsfp1] [get_bd_ports lane_up_qsfp1]
connect_bd_net [get_bd_pins qsfp_phys/sys_reset_out_qsfp1] [get_bd_pins sys_reset_invert_qsfp1/Op1]
connect_bd_net [get_bd_pins qsfp_phys/user_clk_qsfp1] [get_bd_pins qsfp_data_gen_recv/qsfp1_user_clk]
connect_bd_net [get_bd_pins rst_ddr4_0_266M/peripheral_aresetn] \
  [get_bd_pins axi_mem_intercon/ARESETN] [get_bd_pins axi_mem_intercon/M00_ARESETN] [get_bd_pins ddr4_0/c0_ddr4_aresetn] \
  [get_bd_pins ps8_0_axi_periph/M02_ARESETN] [get_bd_pins system_ila_ddr4/resetn]
connect_bd_net -net rst_ps8_0_99M_peripheral_aresetn [get_bd_pins rst_100M/peripheral_aresetn] \
  [get_bd_pins qsfp_data_gen_recv/s_axis_aresetn] [get_bd_pins axi_mem_intercon/S00_ARESETN] \
  [get_bd_pins ps8_0_axi_periph/ARESETN] [get_bd_pins ps8_0_axi_periph/S00_ARESETN] \
  [get_bd_pins ps8_0_axi_periph/M00_ARESETN] [get_bd_pins ps8_0_axi_periph/M01_ARESETN]
connect_bd_net [get_bd_pins sys_reset_invert_qsfp1/Res] [get_bd_pins qsfp_data_gen_recv/qsfp1_sys_resetn]
connect_bd_net -net util_vector_logic_0_Res [get_bd_pins sys_reset_invert_qsfp0/Res] [get_bd_pins qsfp_data_gen_recv/qsfp0_sys_resetn]
connect_bd_net [get_bd_pins zynq_ultra_ps_e_0/pl_resetn0] [get_bd_pins rst_100M/ext_reset_in]

# ---- address map ----
assign_bd_address -offset 0x0080000000 -range 4K -target_address_space [get_bd_addr_spaces zynq_ultra_ps_e_0/Data] [get_bd_addr_segs qsfp_data_gen_recv/axi_fifo_mm_qsfp0/S_AXI/Mem0]
assign_bd_address -offset 0x0080001000 -range 4K -target_address_space [get_bd_addr_spaces zynq_ultra_ps_e_0/Data] [get_bd_addr_segs qsfp_data_gen_recv/axi_fifo_mm_qsfp1/S_AXI/Mem0]
assign_bd_address -offset 0x0080002000 -range 4K -target_address_space [get_bd_addr_spaces zynq_ultra_ps_e_0/Data] [get_bd_addr_segs ddr4_0/C0_DDR4_MEMORY_MAP_CTRL/C0_REG]
assign_bd_address -offset 0x1000000000 -range 8G -target_address_space [get_bd_addr_spaces zynq_ultra_ps_e_0/Data] [get_bd_addr_segs ddr4_0/C0_DDR4_MEMORY_MAP/C0_DDR4_ADDRESS_BLOCK]

validate_bd_design
save_bd_design
